# Altium project FOC_DRV8323.PrjPcb
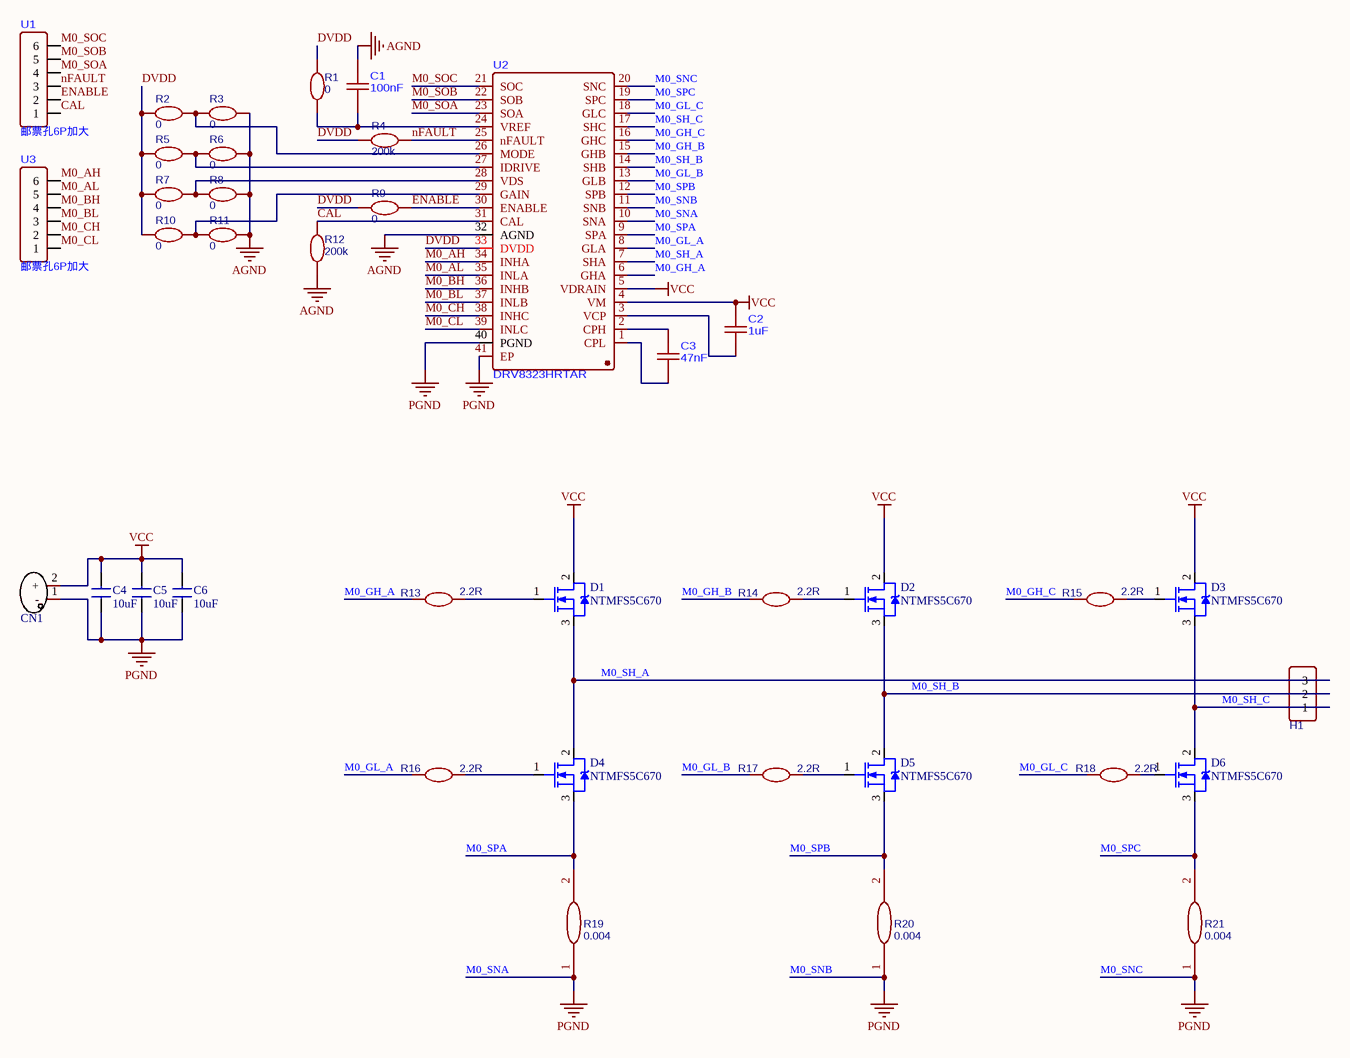
[diagram p0: FOC_DRV8323.SchDoc]
2 sheets, 73 parts. Net scope: global (net labels, ports and power ports of the same name join across sheets).
Board file: FOC_DRV8323.PcbDoc
Sheets:
  FOC_DRV8323.SchDoc
  FOC_STM32G431.SchDoc

## Sheet FOC_DRV8323.SchDoc
size A2; SheetNumber: 1; SheetTotal: 2

### Parts
C1  100nF  [c0402]
C2  1uF  [c0402]
C3  47nF  [c0402]
C4  10uF  [1210]
C5  10uF  [1210]
C6  10uF  [1210]
CN1  XT30_1  [XT30卧式焊盘]  (value not drawn)
D1  NTMFS5C670  [pg-tdson-8]
D2  NTMFS5C670  [pg-tdson-8]
D3  NTMFS5C670  [pg-tdson-8]
D4  NTMFS5C670  [pg-tdson-8]
D5  NTMFS5C670  [pg-tdson-8]
D6  NTMFS5C670  [pg-tdson-8]
H1  MR30-M  [MR30]  (value not drawn)
R1  0  [R0402]
R2  0  [R0402]
R3  0  [R0402]
R4  200k  [R0402]
R5  0  [R0402]
R6  0  [R0402]
R7  0  [R0402]
R8  0  [R0402]
R9  0  [R0402]
R10  0  [R0402]
R11  0  [R0402]
R12  200k  [R0402]
R13  2.2R  [R0402]
R14  2.2R  [R0402]
R15  2.2R  [R0402]
R16  2.2R  [R0402]
R17  2.2R  [R0402]
R18  2.2R  [R0402]
R19  0.004  [R0612]
R20  0.004  [R0612]
R21  0.004  [R0612]
U1  邮票孔6P加大  [PCBComponent_1___pad]
U2  DRV8323HRTAR  [QFN-40_L6.0-W6.0-P0.50-BL-EP4.5]
U3  邮票孔6P加大  [PCBComponent_1___pad]

### Nets
AGND: C1.2 R3.1 R6.1 R8.1 R11.1 R12.2 U2.32(AGND)
M0_SNA: C4.1 C5.1 C6.1 CN1.1(-) R19.1 R20.1 R21.1 U2.10(SNA) U2.11(SNB) U2.20(SNC) U2.40(PGND) U2.41(EP)  [also labelled M0_SNB, M0_SNC, PGND]
VCC: C2.2 C4.2 C5.2 C6.2 CN1.2(+) D1.2(D) D2.2(D) D3.2(D) U2.4(VM) U2.5(VDRAIN)
CAL: R12.1 U1.6(1) U2.31(CAL)
DVDD: R1.1 R2.2 R4.1 R5.2 R7.2 R9.2 R10.2 U2.33(DVDD)
ENABLE: R9.1 U1.5(2) U2.30(ENABLE)
M0_AH: U2.34(INHA) U3.1(6)
M0_AL: U2.35(INLA) U3.2(5)
M0_BH: U2.36(INHB) U3.3(4)
M0_BL: U2.37(INLB) U3.4(3)
M0_CH: U2.38(INHC) U3.5(2)
M0_CL: U2.39(INLC) U3.6(1)
M0_GH_A: R13.2 U2.6(GHA)
M0_GH_B: R14.2 U2.15(GHB)
M0_GH_C: R15.2 U2.16(GHC)
M0_GL_A: R16.2 U2.8(GLA)
M0_GL_B: R17.2 U2.13(GLB)
M0_GL_C: R18.2 U2.18(GLC)
M0_SH_A: D1.3(S) D4.2(D) H1.3 U2.7(SHA)
M0_SH_B: D2.3(S) D5.2(D) H1.2 U2.14(SHB)
M0_SH_C: D3.3(S) D6.2(D) H1.1 U2.17(SHC)
M0_SOA: U1.3(4) U2.23(SOA)
M0_SOB: U1.2(5) U2.22(SOB)
M0_SOC: U1.1(6) U2.21(SOC)
M0_SPA: D4.3(S) R19.2 U2.9(SPA)
M0_SPB: D5.3(S) R20.2 U2.12(SPB)
M0_SPC: D6.3(S) R21.2 U2.19(SPC)
nFAULT: R4.2 U1.4(3) U2.25(nFAULT)
NetC1_1: C1.1 R1.2 U2.24(VREF)
NetC2_1: C2.1 U2.3(VCP)
NetC3_1: C3.1 U2.1(CPL)
NetC3_2: C3.2 U2.2(CPH)
NetD1_1: D1.1(G) R13.1
NetD2_1: D2.1(G) R14.1
NetD3_1: D3.1(G) R15.1
NetD4_1: D4.1(G) R16.1
NetD5_1: D5.1(G) R17.1
NetD6_1: D6.1(G) R18.1
NetR2_1: R2.1 R3.2 U2.26(MODE)
NetR5_1: R5.1 R6.2 U2.27(IDRIVE)
NetR7_1: R7.1 R8.2 U2.28(VDS)
NetR10_1: R10.1 R11.2 U2.29(GAIN)

### Library data of the parts
C1-C3 = CC0201JRX7R9BB101
C4-C6 = 1210贴片电容
D1-D6 = NTMFS5C670: N沟道MOS管; Note: Pin 2 is electrically connected to pin 4.; Published: 8-Jun-2000; LatestRevisionDate: 17-Jul-2002; LatestRevisionNote: Re-released for DXP Platform.; DatasheetVersion: PD-9.814; PackageVersion: Feb-1997; PackageReference: TO-220AB; Publisher: Altium Limited; PackageDescription: TO, Thru-Hole, Vertical, Heatsink Mounted; 3 In-Line Leads; Pitch 2.54 mm; ComponentLink1Description: Manufacturer Link; ComponentLink1URL: http://www.irf.com/
H1 = MR30-M: BOM_Manufacturer: AMASS(艾迈斯); Contributor: LCEDA_Lib; BOM_Supplier Part: C99873; BOM_Supplier: LCSC; BOM_Manufacturer Part: MR30-M; spicePre: H; spiceSymbolName: HDR-F-2.54_1x3
R1-R18 = 2.2R: BOM_Manufacturer Part: 0603WAJ022JT5E; BOM_Manufacturer: UniOhm; nameAlias: Value(Ω); spicePre: R; spiceSymbolName: Res_0603(1/10W)_EU; BOM_Supplier: LCSC; BOM_Supplier Part: C25226
R19-R21 = 0.0005: BOM_Manufacturer: RALEC(旺诠); BOM_Manufacturer Part: LR2512-23R0005J4; nameAlias: Resistance (Ohms); Contributor: LCSC; BOM_Supplier: LCSC; BOM_Supplier Part: C2681067; spicePre: R; spiceSymbolName: LCSR2512FL500K9L

## Sheet FOC_STM32G431.SchDoc
size A4; SheetNumber: 2; SheetTotal: 2
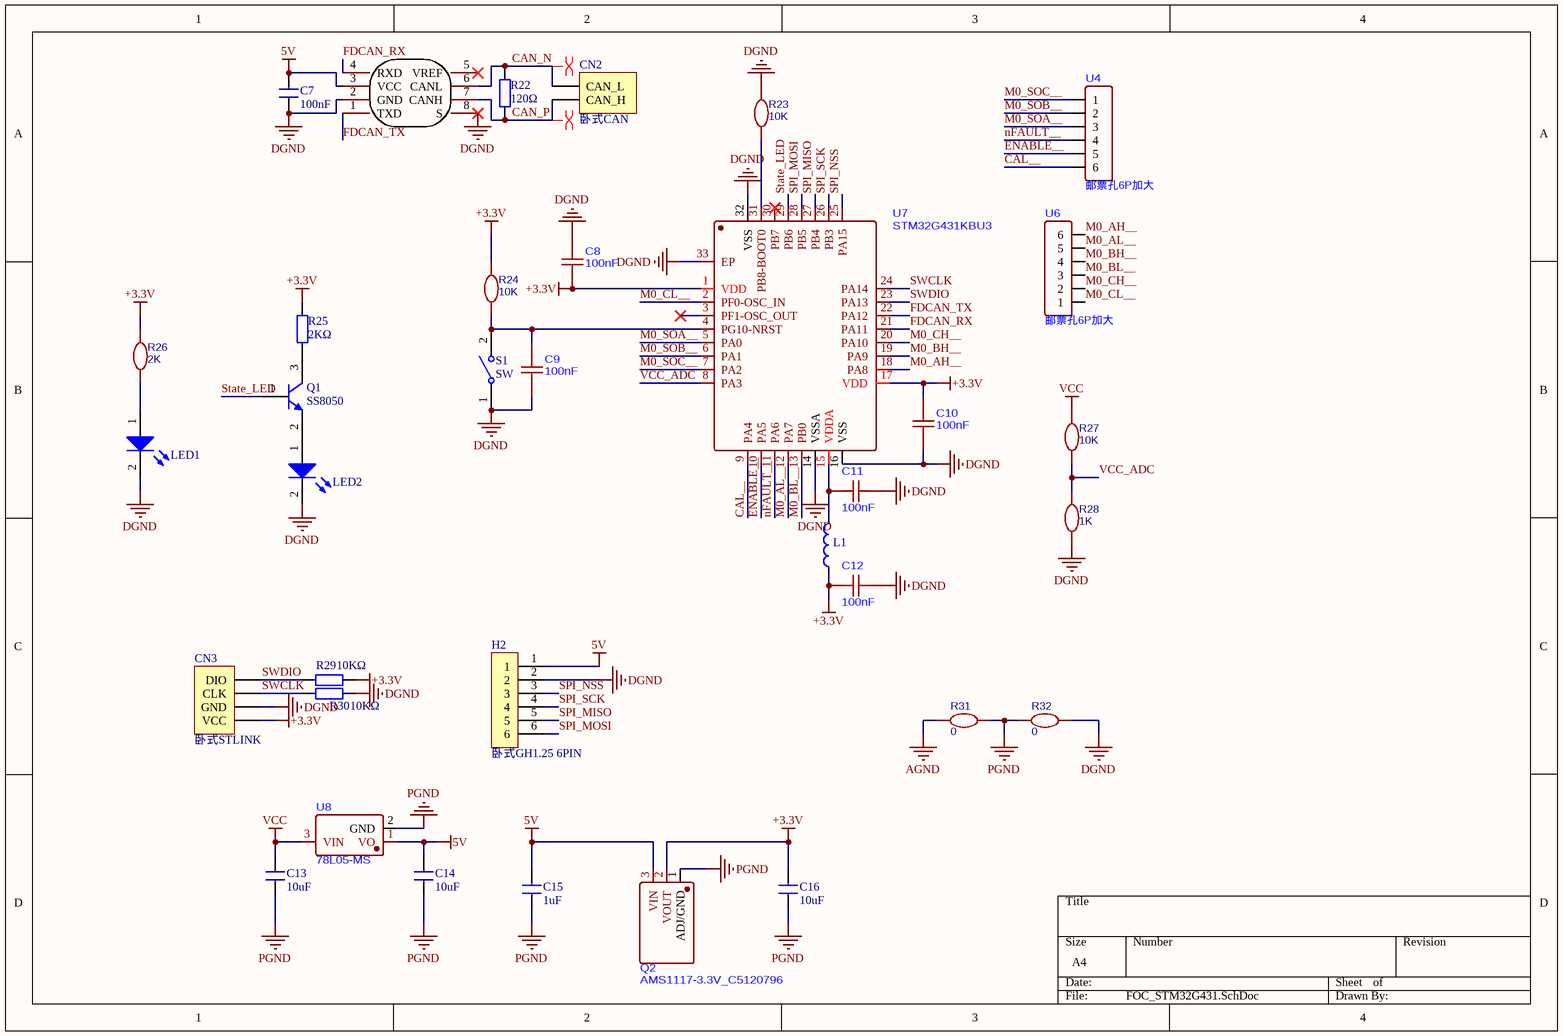
[diagram p1: FOC_STM32G431.SchDoc]

### Parts
C7  100nF  [c0402]
C8  100nF  [c0402]
C9  100nF  [c0402]
C10  100nF  [c0402]
C11  100nF  [c0402]
C12  100nF  [c0402]
C13  10uF  [1210]
C14  10uF  [1210]
C15  1uF  [c0402]
C16  10uF  [1210]
CN2  卧式CAN  [GH1.25 2P 卧式]
CN3  卧式STLINK  [CONN-SMD_4P-P1.25_GH1.25-4P]
H2  卧式GH1.25 6PIN  [CONN-SMD_6P-P1.25_XYECONN_XY-GH1.25-6A61]
L1  1008屏蔽电感  [R0603]  (value not drawn)
LED1  LED  [led0805]  (value not drawn)
LED2  LED  [led0805]  (value not drawn)
Q1  SS8050  [SOT-23-3_L2.9-W1.3-P1.90-LS2.4-BR]
Q2  AMS1117-3.3V_C5120796  [SOT-89-3_L4.5-W2.5-P1.50-LS4.2-BR]
R22  120Ω  [R0402]
R23  10K  [R0402]
R24  10K  [R0402]
R25  2KΩ  [R0402]
R26  2K  [R0402]
R27  10K  [R0402]
R28  1K  [R0402]
R29  10KΩ  [R0402]
R30  10KΩ  [R0402]
R31  0  [R0402]
R32  0  [R0402]
S1  SW  [KEY_SMD]
U4  邮票孔6P加大  [PCBComponent_1 - duplicate]
U5  SN65HVD1050DR  [SOIC-8_L4.9-W3.9-P1.27-LS6.0-BL]  (value not drawn)
U6  邮票孔6P加大  [PCBComponent_1 - duplicate]
U7  STM32G431KBU3  [UFQFPN-32_L5.0-W5.0-P0.50-BL-EP3.5]
U8  78L05-MS  [SOT-89-3_L4.5-W2.5-P1.50-LS4.2-BR]

### Nets
5V: C7.2 C14.2 C15.2 H2.1 Q2.3(VIN) U5.3(VCC) U8.1(VO)
+3.3V: C8.2 C10.2 C12.2 C16.2 CN3.1(VCC) L1.1 Q2.2(VOUT) R24.1 R25.2 R26.1 R29.1 U7.1(VDD) U7.17(VDD)
AGND: R31.1
DGND: C7.1 C8.1 C9.1 C10.1 C11.1 C12.1 CN3.2(GND) H2.2 LED1.2(K) LED2.2(K) R23.1 R28.1 R30.2 R32.2 S1.1(COMMON) U5.2(GND) U5.8(S) U7.14(VSSA) U7.16(VSS) U7.32(VSS) U7.33(EP)
PGND: C13.1 C14.1 C15.1 C16.1 Q2.1(ADJ/GND) R31.2 R32.1 U8.2(GND)  [project net M0_SNA]
VCC: C13.2 R27.2 U8.3(VIN)
CAL__: U4.1(6) U7.9(PA4)
CAN_N: CN2.2(CAN_L) R22.2 U5.6(CANL)
CAN_P: CN2.1(CAN_H) R22.1 U5.7(CANH)
ENABLE__: U4.2(5) U7.10(PA5)
FDCAN_RX: U5.4(RXD) U7.21(PA11)
FDCAN_TX: U5.1(TXD) U7.22(PA12)
M0_AH__: U6.1(6) U7.18(PA8)
M0_AL__: U6.2(5) U7.12(PA7)
M0_BH__: U6.3(4) U7.19(PA9)
M0_BL__: U6.4(3) U7.13(PB0)
M0_CH__: U6.5(2) U7.20(PA10)
M0_CL__: U6.6(1) U7.2(PF0-OSC_IN)
M0_SOA__: U4.4(3) U7.5(PA0)
M0_SOB__: U4.5(2) U7.6(PA1)
M0_SOC__: U4.6(1) U7.7(PA2)
nFAULT__: U4.3(4) U7.11(PA6)
SPI_MISO: H2.5 U7.27(PB4)
SPI_MOSI: H2.6 U7.28(PB5)
SPI_NSS: H2.3 U7.25(PA15)
SPI_SCK: H2.4 U7.26(PB3)
State_LED: Q1.1(B) U7.29(PB6)
SWCLK: CN3.3(CLK) R30.1 U7.24(PA14)
SWDIO: CN3.4(DIO) R29.2 U7.23(PA13)
VCC_ADC: R27.1 R28.2 U7.8(PA3)
NetC9_2: C9.2 R24.2 S1.2(NO) U7.4(PG10-NRST)
NetC11_2: C11.2 L1.2 U7.15(VDDA)
NetLED1_1: LED1.1(A) R26.2
NetLED2_1: LED2.1(A) Q1.2(E)
NetQ1_3: Q1.3(C) R25.1
NetR23_2: R23.2 U7.31(PB8-BOOT0)

Not connected (* = marked no-connect by the designer): U5 5(VREF)*; U7 3(PF1-OSC_OUT)* 30(PB7)*

### Layout directives
differential pair: CAN_N, CAN_P

### Library data of the parts
C7 C15 = 0402贴片电容: 贴片电容0402
C8-C12 = CC0201JRX7R9BB101
C13 C14 C16 = 1210贴片电容
LED1 LED2 = 0805贴片LED
Q1 = 2N2222: 三极管
R22 R25 R29 R30 = 0402贴片电阻: W: *
R23 R24 R26-R28 R31 R32 = 2.2R: as R1 on sheet FOC_DRV8323; spicePre: R; spiceSymbolName: Res_0603(1/10W)_EU; BOM_Supplier: LCSC; BOM_Supplier Part: C25226
S1 = SW: 开关
U5 = SN65HVD1050DR: CAN芯片; Manufacturer: TI(德州仪器); Add into BOM: yes; Supply Voltage: 4.5V~5.5V; Supply Current: 50mA; Name: SN65HVD1050DR; Symbol: SN65HVD1050DR; Device: SN65HVD1050DR; LCSC Part Name: 4.5V~5.5V; Supplier Part: C14019; Manufacturer Part: SN65HVD1050DR; Supplier Footprint: SOIC-8; JLCPCB Part Class: Extended Part; Datasheet: https://www.ti.com/cn/lit/gpn/sn65hvd1050; Supplier: LCSC; Convert to PCB: yes; Type: 收发器; Operating Temperature: -40℃~+125℃
CN2 = 卧式CAN: LatestRevisionDate: 17-Jul-2002; LatestRevisionNote: Re-released for DXP Platform.; Publisher: Altium Limited

## Nets that join several sheets
AGND: FOC_DRV8323 (7 pins), FOC_STM32G431 (R31.1)
M0_SNA: FOC_DRV8323 (12 pins), FOC_STM32G431 (8 pins)
VCC: FOC_DRV8323 (10 pins), FOC_STM32G431 (C13.2 R27.2 U8.3)